# Altium project rpi_pico_2_hat.PrjPcb
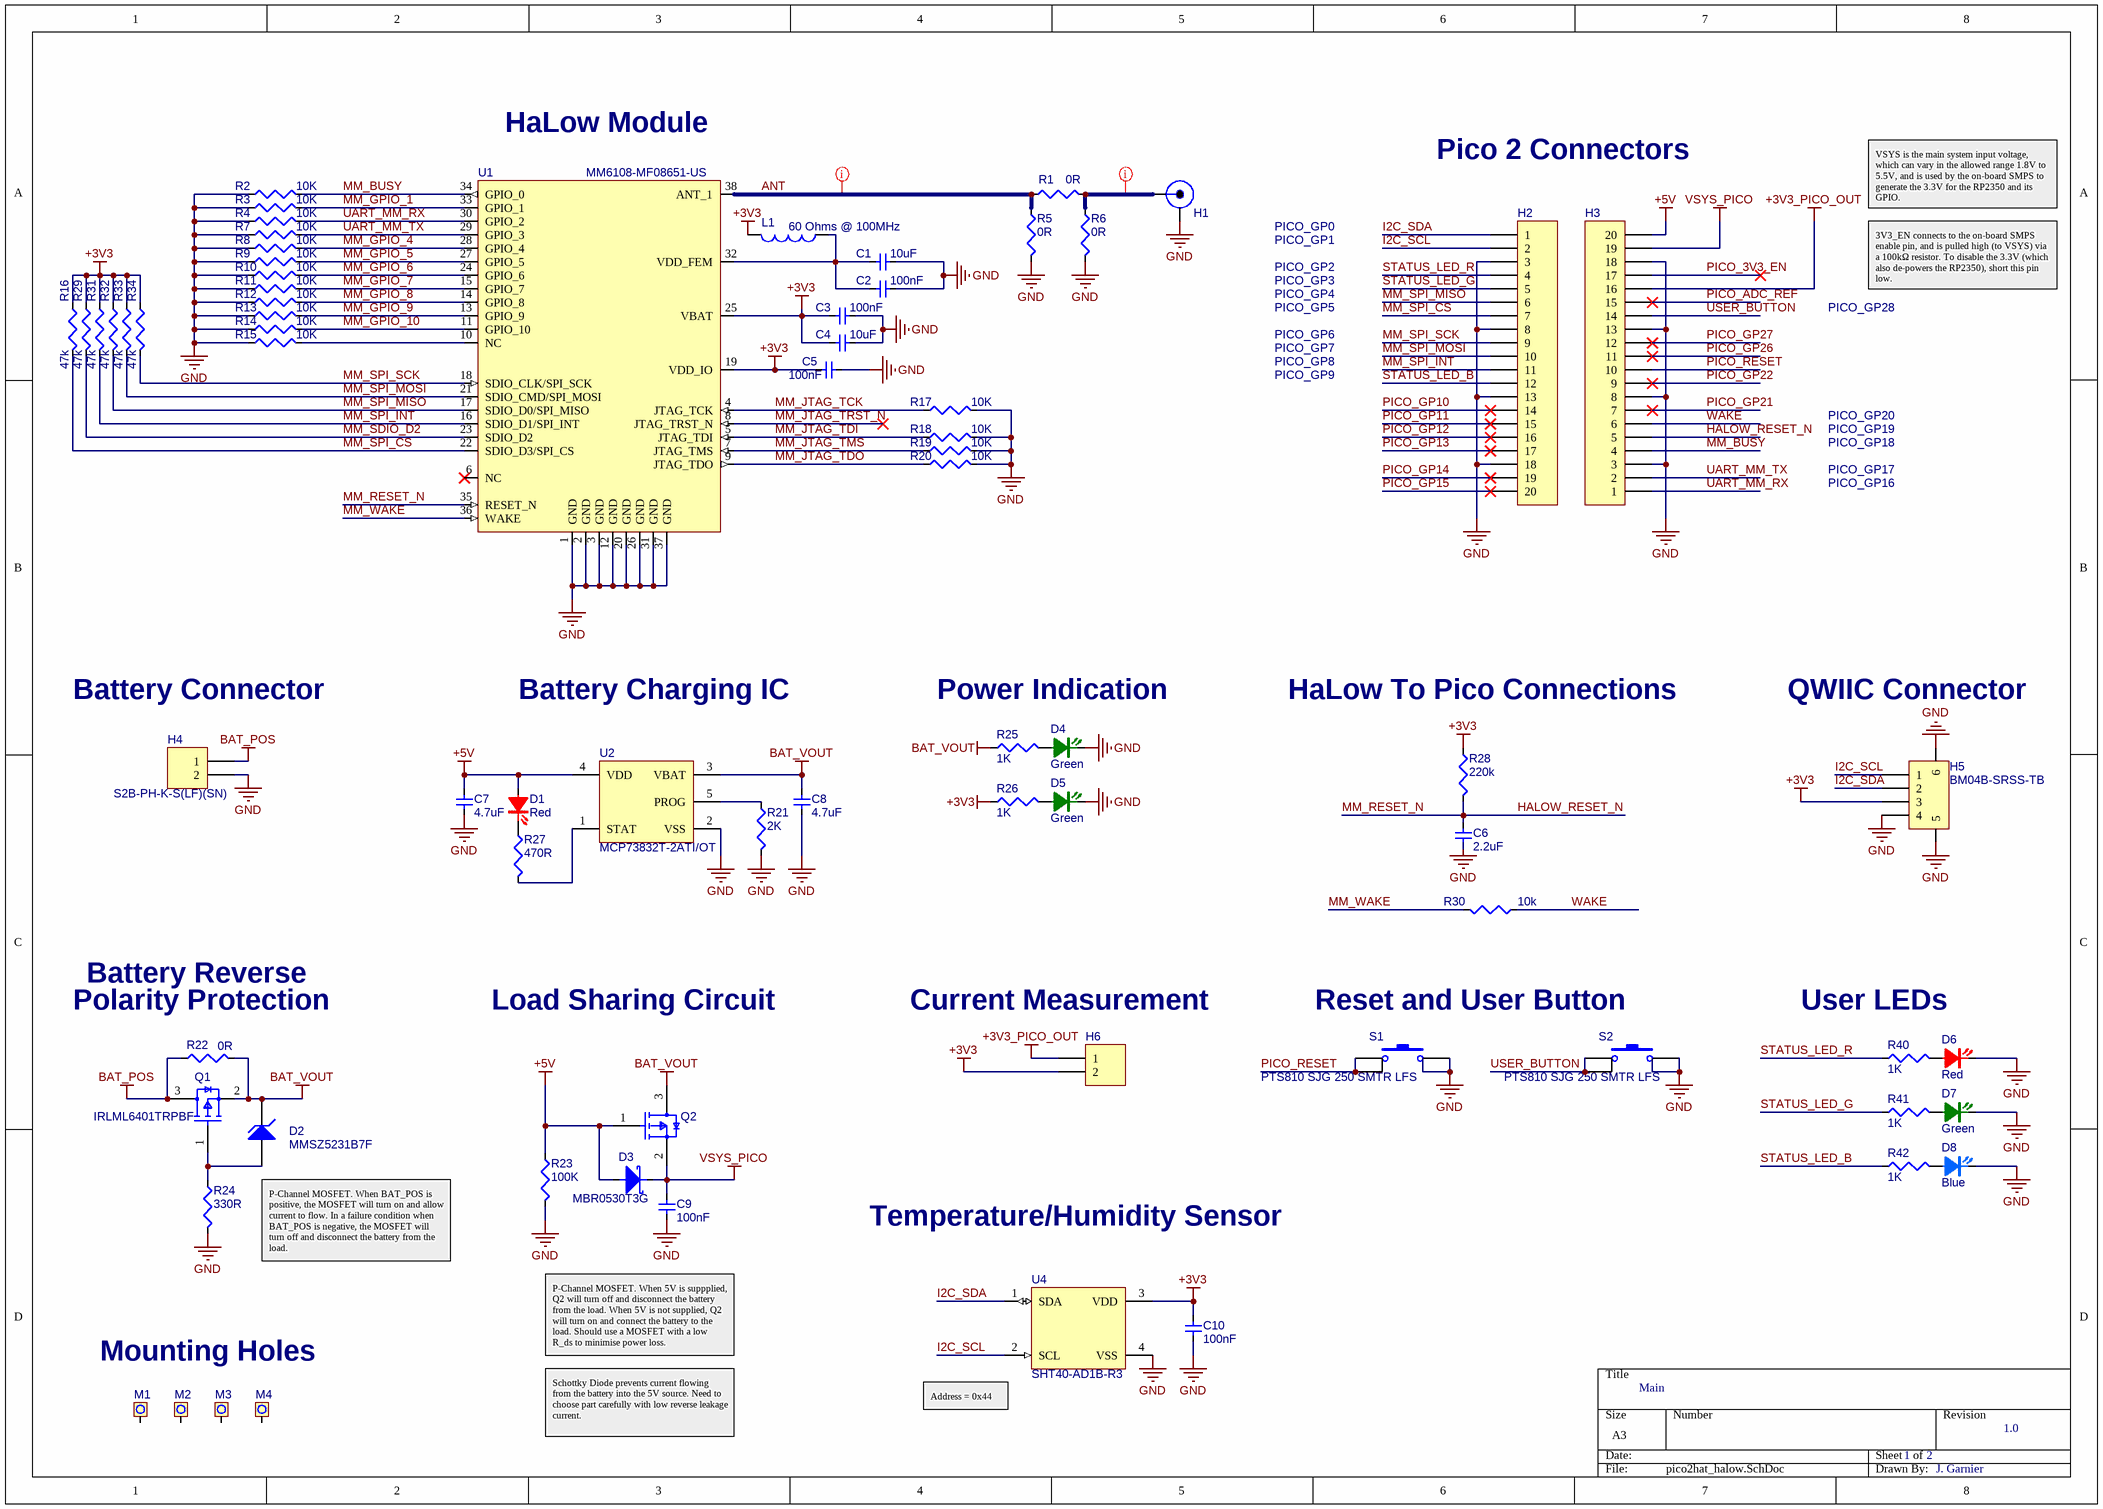
[diagram p0: pico2hat_halow.SchDoc]
Rev: 1.0; DrawnBy: J. Garnier
2 sheets, 73 parts. Net scope: global (net labels, ports and power ports of the same name join across sheets).
Board file: rpi_pico_2_hat.PcbDoc
Sheets:
  pico2hat_halow.SchDoc
  Revision_History.SchDoc

## Sheet pico2hat_halow.SchDoc: Main
size A3; Author: J. Garnier; DrawnBy: J. Garnier; Revision: 1.0; SheetNumber: 1; SheetTotal: 2

### Parts
C1  value 10uF  [0402_cap]  (hidden comment: CL05A106MP8NUB8)
C2  value 100nF  [0402_cap]  (hidden comment: C1005X7R1H104K050BE)
C3  value 100nF  [0402_cap]  (hidden comment: C1005X7R1H104K050BE)
C4  value 10uF  [0402_cap]  (hidden comment: CL05A106MP8NUB8)
C5  value 100nF  [0402_cap]  (hidden comment: C1005X7R1H104K050BE)
C6  value 2.2uF  [CAPC1005X06N]  (hidden comment: CAP)
C7  value 4.7uF  [0402_cap]  (hidden comment: C1005X5R0J475K050BC)
C8  value 4.7uF  [0402_cap]  (hidden comment: C1005X5R0J475K050BC)
C9  value 100nF  [0402_cap]  (hidden comment: C1005X7R1H104K050BE)
C10  value 100nF  [0402_cap]  (hidden comment: C1005X7R1H104K050BE)
D1  value Red  [LED_0805_RED]  (hidden comment: LTST-C170KRKT)
D2  MMSZ5231B7F  [SOD-123FL]
D3  MBR0530T3G  [SOD-123FL]
D4  value Green  [LED_0402_GREEN]  (hidden comment: XZVGR68W-3)
D5  value Green  [LED_0402_GREEN]  (hidden comment: XZVGR68W-3)
D6  value Red  [LED_0805_RED]  (hidden comment: LTST-C170KRKT)
D7  value Green  [LED_0805_GREEN]  (hidden comment: LTST-C170KGKT)
D8  value Blue  [LED_0805_BLUE]  (hidden comment: LTST-C170TBKT)
H1  142-0761-861  [SMA_EMERSON_142_0761_861]  (value not drawn)
H2  1x20 Female Header  [HDR1X20F]  (value not drawn)
H3  1x20 Female Header  [HDR1X20F]  (value not drawn)
H4  S2B-PH-K-S(LF)(SN)  [JST-S2B-PH-K-S_V]
H5  BM04B-SRSS-TB  [FP-BM04B-SRSS-TBT_LF_SN-MFG]
H6  2011-1X02G00SB-1  [HDR1X2]  (value not drawn)
L1  value 60 Ohms @ 100MHz  [0402_ind]  (hidden comment: BLM15PX600SN1D)
M1  PAD0009  [MH_300_275_NPTH]  (value not drawn)
M2  PAD0009  [MH_300_275_NPTH]  (value not drawn)
M3  PAD0009  [MH_300_275_NPTH]  (value not drawn)
M4  PAD0009  [MH_300_275_NPTH]  (value not drawn)
Q1  IRLML6401TRPBF  [FP-SOT23-IPC_A]
Q2  NTS4101PT1G  [FP-419-04-IPC_A]  (value not drawn)
R1  value 0R  [0402_res]  (hidden comment: RC0402JR-070RL)
R2  value 10K  [RESC1005X04N]  (hidden comment: ERJ-2RKF1002X)
R3  value 10K  [RESC1005X04N]  (hidden comment: ERJ-2RKF1002X)
R4  value 10K  [RESC1005X04N]  (hidden comment: ERJ-2RKF1002X)
R5  value 0R  [0402_res]  (hidden comment: RC0402JR-070RL)
R6  value 0R  [0402_res]  (hidden comment: RC0402JR-070RL)
R7  value 10K  [RESC1005X04N]  (hidden comment: ERJ-2RKF1002X)
R8  value 10K  [RESC1005X04N]  (hidden comment: ERJ-2RKF1002X)
R9  value 10K  [RESC1005X04N]  (hidden comment: ERJ-2RKF1002X)
R10  value 10K  [RESC1005X04N]  (hidden comment: ERJ-2RKF1002X)
R11  value 10K  [RESC1005X04N]  (hidden comment: ERJ-2RKF1002X)
R12  value 10K  [RESC1005X04N]  (hidden comment: ERJ-2RKF1002X)
R13  value 10K  [RESC1005X04N]  (hidden comment: ERJ-2RKF1002X)
R14  value 10K  [RESC1005X04N]  (hidden comment: ERJ-2RKF1002X)
R15  value 10K  [RESC1005X04N]  (hidden comment: ERJ-2RKF1002X)
R16  value 47k  [RESC1005X04N]  (hidden comment: MCR01MZPF4702)
R17  value 10K  [RESC1005X04N]  (hidden comment: ERJ-2RKF1002X)
R18  value 10K  [RESC1005X04N]  (hidden comment: ERJ-2RKF1002X)
R19  value 10K  [RESC1005X04N]  (hidden comment: ERJ-2RKF1002X)
R20  value 10K  [RESC1005X04N]  (hidden comment: ERJ-2RKF1002X)
R21  value 2K  [0402_res]  (hidden comment: RC0402FR-072KL)
R22  value 0R  [RESC1608X06N]  (hidden comment: RC0603JR-070RL)
R23  value 100K  [0402_res]  (hidden comment: RC0402FR-07100KL)
R24  value 330R  [RESC1005X04N]  (hidden comment: RC0402FR-07330RL)
R25  value 1K  [RESC1005X04N]  (hidden comment: ERJ-2RKF1001X)
R26  value 1K  [RESC1005X04N]  (hidden comment: ERJ-2RKF1001X)
R27  value 470R  [0402_res]  (hidden comment: RC0402FR-07470RL)
R28  value 220k  [RESC1005X04N]  (hidden comment: RES)
R29  value 47k  [RESC1005X04N]  (hidden comment: MCR01MZPF4702)
R30  value 10k  [RESC1608X06N]  (hidden comment: RES)
R31  value 47k  [RESC1005X04N]  (hidden comment: MCR01MZPF4702)
R32  value 47k  [RESC1005X04N]  (hidden comment: MCR01MZPF4702)
R33  value 47k  [RESC1005X04N]  (hidden comment: MCR01MZPF4702)
R34  value 47k  [RESC1005X04N]  (hidden comment: MCR01MZPF4702)
R40  value 1K  [RESC1005X04N]  (hidden comment: ERJ-2RKF1001X)
R41  value 1K  [RESC1005X04N]  (hidden comment: ERJ-2RKF1001X)
R42  value 1K  [RESC1005X04N]  (hidden comment: ERJ-2RKF1001X)
S1  PTS810 SJG 250 SMTR LFS  [SW_PTS810]
S2  PTS810 SJG 250 SMTR LFS  [SW_PTS810]
U1  MM6108-MF08651-US  [MF04]
U2  MCP73832T-2ATI/OT  [SOT-23-OT5_N]
U4  SHT40-AD1B-R3  [DFN140P150X59-4N]

### Nets
+3V3: C3.1 C4.1 C5.1 C10.2 H5.3 H6.2 L1.2 R16.1 R26.1 R28.1 R29.1 R31.1 R32.1 R33.1 R34.1 U1.19(VDD_IO) U1.25(VBAT) U4.3(VDD)
+3V3_PICO_OUT: H3.16 H6.1
+5V: C7.1 D1.A D3.A H3.20 Q2.1(G) R23.1 U2.4(VDD)
BAT_POS: H4.1 Q1.3(D) R22.1
BAT_VOUT: C8.1 D2.K Q1.2(S) Q2.3(D) R22.2 R25.1 U2.3(VBAT)
GND: C1.2 C2.2 C3.2 C4.2 C5.2 C6.2 C7.2 C8.2 C9.1 C10.1 D4.K D5.K D6.K D7.K D8.K H1.2 H2.3 H2.8 H2.13 H2.18 H3.3 H3.8 H3.13 H3.18 H4.2 H5.4 H5.5 H5.6 R2.1 R3.1 R4.1 R5.2 R6.2 R7.1 R8.1 R9.1 R10.1 R11.1 R12.1 R13.1 R14.1 R15.1 R17.2 R18.2 R19.2 R20.2 R21.2 R23.2 R24.2 S1.3 S1.4 S2.3 S2.4 U1.1(GND) U1.2(GND) U1.3(GND) U1.12(GND) U1.20(GND) U1.26(GND) U1.31(GND) U1.37(GND) U2.2(VSS) U4.4(VSS)
VSYS_PICO: C9.2 D3.K H3.19 Q2.2(S)
ANT: R1.1 R5.1 U1.38(ANT_1)
HALOW_RESET_N: C6.1 H3.5 R28.2 U1.35(RESET_N)  [also labelled MM_RESET_N]
I2C_SCL: H2.2 H5.1 U4.2(SCL)
I2C_SDA: H2.1 H5.2 U4.1(SDA)
MM_BUSY: H3.4 R2.2 U1.34(GPIO_0)
MM_GPIO_1: R3.2 U1.33(GPIO_1)
MM_GPIO_4: R8.2 U1.28(GPIO_4)
MM_GPIO_5: R9.2 U1.27(GPIO_5)
MM_GPIO_6: R10.2 U1.24(GPIO_6)
MM_GPIO_7: R11.2 U1.15(GPIO_7)
MM_GPIO_8: R12.2 U1.14(GPIO_8)
MM_GPIO_9: R13.2 U1.13(GPIO_9)
MM_GPIO_10: R14.2 U1.11(GPIO_10)
MM_JTAG_TCK: R17.1 U1.4(JTAG_TCK)
MM_JTAG_TDI: R18.1 U1.5(JTAG_TDI)
MM_JTAG_TDO: R20.1 U1.9(JTAG_TDO)
MM_JTAG_TMS: R19.1 U1.7(JTAG_TMS)
MM_JTAG_TRST_N: U1.8(JTAG_TRST_N)
MM_SDIO_D2: R29.2 U1.23(SDIO_D2)
MM_SPI_CS: H2.7 R16.2 U1.22(SDIO_D3/SPI_CS)
MM_SPI_INT: H2.11 R31.2 U1.16(SDIO_D1/SPI_INT)
MM_SPI_MISO: H2.6 R32.2 U1.17(SDIO_D0/SPI_MISO)
MM_SPI_MOSI: H2.10 R33.2 U1.21(SDIO_CMD/SPI_MOSI)
MM_SPI_SCK: H2.9 R34.2 U1.18(SDIO_CLK/SPI_SCK)
MM_WAKE: R30.1 U1.36(WAKE)
PICO_3V3_EN: H3.17
PICO_ADC_REF: H3.15
PICO_GP10: H2.14
PICO_GP11: H2.15
PICO_GP12: H2.16
PICO_GP13: H2.17
PICO_GP14: H2.19
PICO_GP15: H2.20
PICO_GP21: H3.7
PICO_GP22: H3.9
PICO_GP26: H3.11
PICO_GP27: H3.12
PICO_RESET: H3.10 S1.1 S1.2
STATUS_LED_B: H2.12 R42.1
STATUS_LED_G: H2.5 R41.1
STATUS_LED_R: H2.4 R40.1
UART_MM_RX: H3.1 R4.2 U1.30(GPIO_2)
UART_MM_TX: H3.2 R7.2 U1.29(GPIO_3)
USER_BUTTON: H3.14 S2.1 S2.2
WAKE: H3.6 R30.2
NetC1_1: C1.1 C2.1 L1.1 U1.32(VDD_FEM)
NetD1_K: D1.K R27.1
NetD2_A: D2.A Q1.1(G) R24.1
NetD4_A: D4.A R25.2
NetD5_A: D5.A R26.2
NetD6_A: D6.A R40.2
NetD7_A: D7.A R41.2
NetD8_A: D8.A R42.2
NetH1_1: H1.1 R1.2 R6.1
NetR15_2: R15.2 U1.10(NC)
NetR21_1: R21.1 U2.5(PROG)
NetR27_2: R27.2 U2.1(STAT)

Not connected (* = marked no-connect by the designer): M1 1; M2 1; M3 1; M4 1; U1 6(NC)*

### Layout directives
net class 50 OHMs: ANT, NetH1_1

### Notes on the sheet
- HaLow Module
- Pico 2 Connectors
- PICO_GP0
- PICO_GP1
- VSYS is the main system input voltage, which can vary in the allowed range 1.8V to 5.5V, and is used by the on-board SMPS to generate the 3.3V for the RP2350 and its GPIO.
- PICO_GP5
- PICO_GP2
- PICO_GP3
- PICO_GP4
- PICO_GP28
- 3V3_EN connects to the on-board SMPS enable pin, and is pulled high (to VSYS) via a 100kΩ resistor. To disable the 3.3V (which also de-powers the RP2350), short this pin low.
- PICO_GP6
- PICO_GP8
- PICO_GP7
- PICO_GP9
- PICO_GP19
- PICO_GP18
- PICO_GP20
- PICO_GP16
- PICO_GP17
- Battery Connector
- Battery Charging IC
- Power Indication
- (near R28) HaLow To Pico Connections
- QWIIC Connector
- Battery Reverse
- (near R22) Polarity Protection
- Load Sharing Circuit
- (near H6) Current Measurement
- Reset and User Button
- User LEDs
- P-Channel MOSFET. When BAT_POS is positive, the MOSFET will turn on and allow current to flow. In a failure condition when BAT_POS is negative, the MOSFET will turn off and disconnect the battery from the load.
- Temperature/Humidity Sensor
- Mounting Holes
- P-Channel MOSFET. When 5V is suppplied, Q2 will turn off and disconnect the battery from the load. When 5V is not supplied, Q2 will turn on and connect the battery to the load. Should use a MOSFET with a low R_ds to minimise power loss.
- Schottky Diode prevents current flowing from the battery into the 5V source. Need to choose part carefully with low reverse leakage current.
- (near U4) Address = 0x44
- Level 8, 10-14 Waterloo Street
- Surry Hills, NSW 2010
- Drawn:
- Checked:
- Morse Micro
- Title
- AUSTRALIA
- (c) Copyright 2024
- Approved:
- Date Released:
- Drawing No:
- PCBA No:
- Drawing
- Revision:
- Size:
- A3
- File:
- Sheet
- of

### Library data of the parts
C1 C4 = CAP0046-13: CAP CER 10UF 10V 20% X5R 0402; Generic Allowed: Yes; Subtype: Ceramic; Package: 0402; Tolerance: 20%; ClassName: CHIP_MICRO; Voltage: 10V
C2 C3 C5 C9 C10 = CAP0068-11: CAP CER 100NF 50V ±10% X7R 0402; Subtype: Ceramic; Generic Allowed: Yes; Voltage: 50V; ClassName: CHIP_MICRO; Package: 0402; Tolerance: 10%; Component Rating: X7R
C6 = CAP0086: CAP CER 2.2UF 6.3V 20% X5R 0402; Manufacturer 1: Taiyo Yuden; Manufacturer Part Number 1: JMK105BJ225MV-F; Generic Allowed: Yes; Subtype: Ceramic; Item_Number: CAP0086; Supplier 1: Digi-Key; Supplier Part Number 1: 587-1453-2-ND; ClassName: CHIP_MICRO; Component Rating: X5R; Package: 0402; Tolerance: 20%; Voltage: 6.3V
C7 C8 = CAP0075-12: CAP CER 4.7UF 6.3V ±10% X5R 0402; Generic Allowed: Yes; Subtype: Ceramic; Voltage: 6.3V; ClassName: CHIP_MICRO; Package: 0402; Component Rating: X5R; Tolerance: 10%
D1 D6 = DIO0016-2: LED, Red Clear,2.0V, SMD, 0805, RoHS; Generic Allowed: Yes; Component Rating: Clear, 2.0V; Package: SMD-0805; ClassName: CHIP_OTHER
D2 = DIO0072-1: DIODE ZENER 5.1V 500MW SOD-123
D3 = DIO0044-2: DIODE SCHOTTKY 30V 500MA SOD123; Generic Allowed: Yes; ClassName: COMP_OTHER; Voltage: 30V; Package: SOD-123; Current: 500mA; Value: MBR0530T3G
D4 D5 = DIO0053-3: LED GREEN 0402 SMD; Voltage: 2.0V; Generic Allowed: Yes; Package: 0402; ClassName: CHIP_OTHER
D7 = DIO0015-2: LED, Green Clear,2.0V, SMD, 0805, RoHS; Generic Allowed: Yes; Component Rating: Clear, 2.0V; Package: SMD-0805; ClassName: CHIP_OTHER
D8 = DIO0018-2: LED, Blue Clear,3.3V, SMD, 0805, RoHS; Generic Allowed: Yes; ClassName: CHIP_OTHER; Component Rating: Clear, 3.3V; Package: SMD-0805
H1 = JCK0001-2: Conn, SMA Jack 50 Ohm PCB Edge Mount Gold, RoHS; Generic Allowed: No; ClassName: COMP_OTHER; Package: Edge Mnt
H2 H3 = HDR0128-1
H4 = HDR0129-2: Header for PCB; pitch 2.00mm; 2-contacts; THT; male; side entry; 100V/2A
H5 = HDR0131-2: Board Connector, 4 Contact(s), 1 Row(s), Male, Straight, Surface Mount Terminal
H6 = HDR0006-2: Conn Straight Header 2x1 0.100" 2 POS; Generic Allowed: Yes; Package: THRU-Hole; ClassName: COMP_OTHER; Pins: 2
L1 = IND0062-6: BEAD 60OHMS 2500MA 32 MOHM; DC Resistance: 32mOhm; Generic Allowed: Yes; Current: 2.5A; Resistance: 32mOhm; Package: 0402; ClassName: CHIP_MICRO
M1-M4 = PAD0009-2: MH NPTH 3.00mm DIA 2.75mm HOLE; Shape: Round; ClassName: PCB_PATTERN
Q1 = TSR0020-1: Small Signal Field-Effect Transistor; Transistor Element Material: SILICON; Drain-source On Resistance-Max: 50mR; Power Dissipation-Max (Abs): 1.3W; Drain Current-Max (Abs) (ID): 4.3A; Polarity/Channel Type: P-CHANNEL; Number of Elements: 1; DS Breakdown Voltage-Min: 12V; Transistor Application: SWITCHING; FET Technology: METAL-OXIDE SEMICONDUCTOR; Qualification Status: Not Qualified; Additional Feature: HIGH RELIABILITY; Operating Mode: ENHANCEMENT MODE; Avalanche Energy Rating (Eas): 33mJ; Pulsed Drain Current-Max (IDM): 34A; Package Body Material: Plastic; Time @ Peak Reflow Temperature-Max (s): 30s; Package Shape: Rectangular; RoHS Compliant: Yes; Max Operating Temperature: 150°C; Terminal Finish: Tin; JESD-30 Code: R-PDSO-G3; Reach SVHC Compliant: Yes; Terminal Form: Gull Wing; Moisture Sensitivity Level: 1; Terminal Position: DUAL; Package Style: SMALL OUTLINEMeter; JESD-609 Code: e3; Peak Reflow Temperature (Cel): 260°C; Surface Mount: Yes; Drain Current-Max (ID): 4.3A; Pins: 3
Q2 = TSR0021-1: Small Signal Field-Effect Transistor, 1.37A I(D), 20V, 1-Element, P-Channel, Silicon, Metal-oxide Semiconductor FET; Qualification Status: Not Qualified; Power Dissipation-Max (Abs): 329mW; Feedback Cap-Max (Crss): 85pF; Operating Mode: ENHANCEMENT MODE; Transistor Application: SWITCHING; Time @ Peak Reflow Temperature-Max (s): 40s; Drain-source On Resistance-Max: 120mR; Number of Elements: 1; Package Body Material: Plastic; Terminal Position: DUAL; FET Technology: METAL-OXIDE SEMICONDUCTOR; Terminal Form: Gull Wing; Pins: 3; Reach SVHC Compliant: Yes; DS Breakdown Voltage-Min: 20V; JESD-609 Code: e3; Surface Mount: Yes; Peak Reflow Temperature (Cel): 260°C; Drain Current-Max (Abs) (ID): 1.37A; JESD-30 Code: R-PDSO-G3; Package Style: SMALL OUTLINEMeter; Max Operating Temperature: 150°C; Moisture Sensitivity Level: 1; Drain Current-Max (ID): 1.37A; Terminal Finish: Tin; Transistor Element Material: SILICON; RoHS Compliant: Yes; Package Shape: Rectangular; Polarity/Channel Type: P-CHANNEL
R1 R5 R6 = RES0039-10: RES SMD 0R OHM ±1% 1/16W 0402; Generic Allowed: Yes; Subtype: Thin Film; Power: 1/16W; Tolerance: 1%; Package: 0402; ClassName: CHIP_MICRO
R2-R4 R7-R15 R17-R20 = RES0002-8: RES SMD 10K OHM ±1% 1/10W 0402; Generic Allowed: Yes; Tolerance: 1%; ClassName: CHIP_MICRO; Package: 0402; Power: 1/10W
R16 R29 R31-R34 = RES0086-8: RES SMD 47K OHM ±1% 1/16W 0402; Generic Allowed: Yes; ClassName: CHIP_MICRO; Power: 1/16W; Package: 0402; Tolerance: 1%
R21 = RES0030-9: RES SMD 2K OHM ±1% 1/16W 0402; Generic Allowed: Yes; Package: 0402; ClassName: CHIP_MICRO; Power: 1/16W; Tolerance: 1%
R22 = RES0119-6: RES SMD 0R OHM ±5% 1/10W 0603; Generic Allowed: Yes; Power: 1/10W; Tolerance: 5%; Package: 0603; ClassName: CHIP_OTHER
R23 = RES0023-9: RES SMD 100K OHM ±1% 1/16W 0402; Generic Allowed: Yes; Tolerance: 1%; Package: 0402; ClassName: CHIP_MICRO; Power: 1/16W
R24 = RES0025-8: RES SMD 330R OHM ±1% 1/16W 0402; Generic Allowed: Yes; Tolerance: 1%; Power: 1/16W; Package: 0402; ClassName: CHIP_MICRO
R25 R26 R40-R42 = RES0004-8: RES SMD 1K OHM ±1% 1/10W 0402; Generic Allowed: Yes; Power: 1/10W; Tolerance: 1%; Package: 0402; ClassName: CHIP_MICRO
R27 = RES0084-9: RES SMD 470R OHM ±1% 1/16W 0402; Generic Allowed: Yes; ClassName: CHIP_MICRO; Tolerance: 1%; Package: 0402; Power: 1/16W
R28 = RES0064: Res, 220k Ohms, 1/16W, 1%, 0402,SMD; Manufacturer 1: Rohm; Manufacturer Part Number 1: MCR01MZPF2203; Generic Allowed: Yes; Item_Number: RES0064; Supplier 1: Digi-Key; Supplier Part Number 1: 311-220KLRCT-ND; ClassName: CHIP_MICRO; Package: 0402; Power: 1/16W; Tolerance: 1%; Manufacturer 2: Yageo; Manufacturer Part Number 2: RC0402FR-07220KL; Supplier 2: Digi-Key; Supplier Part Number 2: 311-220KLRTR-ND
R30 = RES0124: Res, 10K Ohm, 1/10W,+/-1%,0603 RoHS; Manufacturer 1: Rohm; Manufacturer Part Number 1: MCR03EZPFX1002; Generic Allowed: Yes; Tolerance: 1%; Item_Number: RES0124; Supplier 1: Digi-Key; Supplier Part Number 1: 311-10.0KHRCT-ND; Package: 0603; Power: 1/10W; Manufacturer 2: Yageo; Manufacturer Part Number 2: RC0603FR-0710KL; Supplier 2: Digi-Key; Supplier Part Number 2: 311-10.0KHRTR-ND; ClassName: CHIP_OTHER
S1 S2 = SWH0026-1: SWITCH TACTILE SPST-NO 0.05A 16V; Generic Allowed: No; Value: PTS810 SJG 250 SMTR LFS; ClassName: COMP_OTHER; Pins: 4; Package: SMD
U1 = MOD0010-3: MM61xx-MF08; Item_Number: MOD0061; Value: MM61xx-MF08251; ClassName: COM_OTHER
U2 = ICT0232-1: Power Supply Support Circuit, Adjustable, 1 Channel, PDSO5; Time @ Peak Reflow Temperature-Max (s): 40s; Adjustable Threshold: Yes; Package Body Material: Plastic; Supply Current-Max (Isup): 1.5mA; Qualification Status: Not Qualified; Power Supplies: 3.3/5V; Channels: 1; Max Supply Voltage: 6V; Package Equivalence Code: TSOP5/6,.11,37; Min Supply Voltage: 3.75V; Terminal Pitch: 0.95mm; RoHS Compliant: Yes; Peak Reflow Temperature (Cel): 260°C; JESD-30 Code: R-PDSO-G5; Case/Package: LSSOP; Reach SVHC Compliant: Yes; Package Shape: Rectangular; Min Operating Temperature: -40°C; JESD-609 Code: e3; Surface Mount: Yes; Terminal Position: DUAL; Moisture Sensitivity Level: 1; Temperature Grade: INDUSTRIAL; Height - Seated (Max): 1.45mm; Max Operating Temperature: 85°C; Terminal Form: Gull Wing; Package Style: SMALL OUTLINE, LOW PROFILE, SHRINK PITCHMeter; Pins: 5; Terminal Finish: Tin; Width: 1.65mm; Throw Configuration: POWER SUPPLY SUPPORT CIRCUIT; Number of Channels: 1; Length: 2.95mm
U4 = ICT0108-3: IC, Humidity Temperature Sensor 0 ~ 100% RH I²C ±1.8% RH 6 s Surface Mount; Generic Allowed: No; ClassName: CHIP_OTHER; Value: SHT40-AD1B-R3; Package: DFN-4

## Sheet Revision_History.SchDoc: Revision History
size A4; Author: J. Garnier; DrawnBy: J. Garnier; Revision: 1.0; SheetNumber: 2; SheetTotal: 2
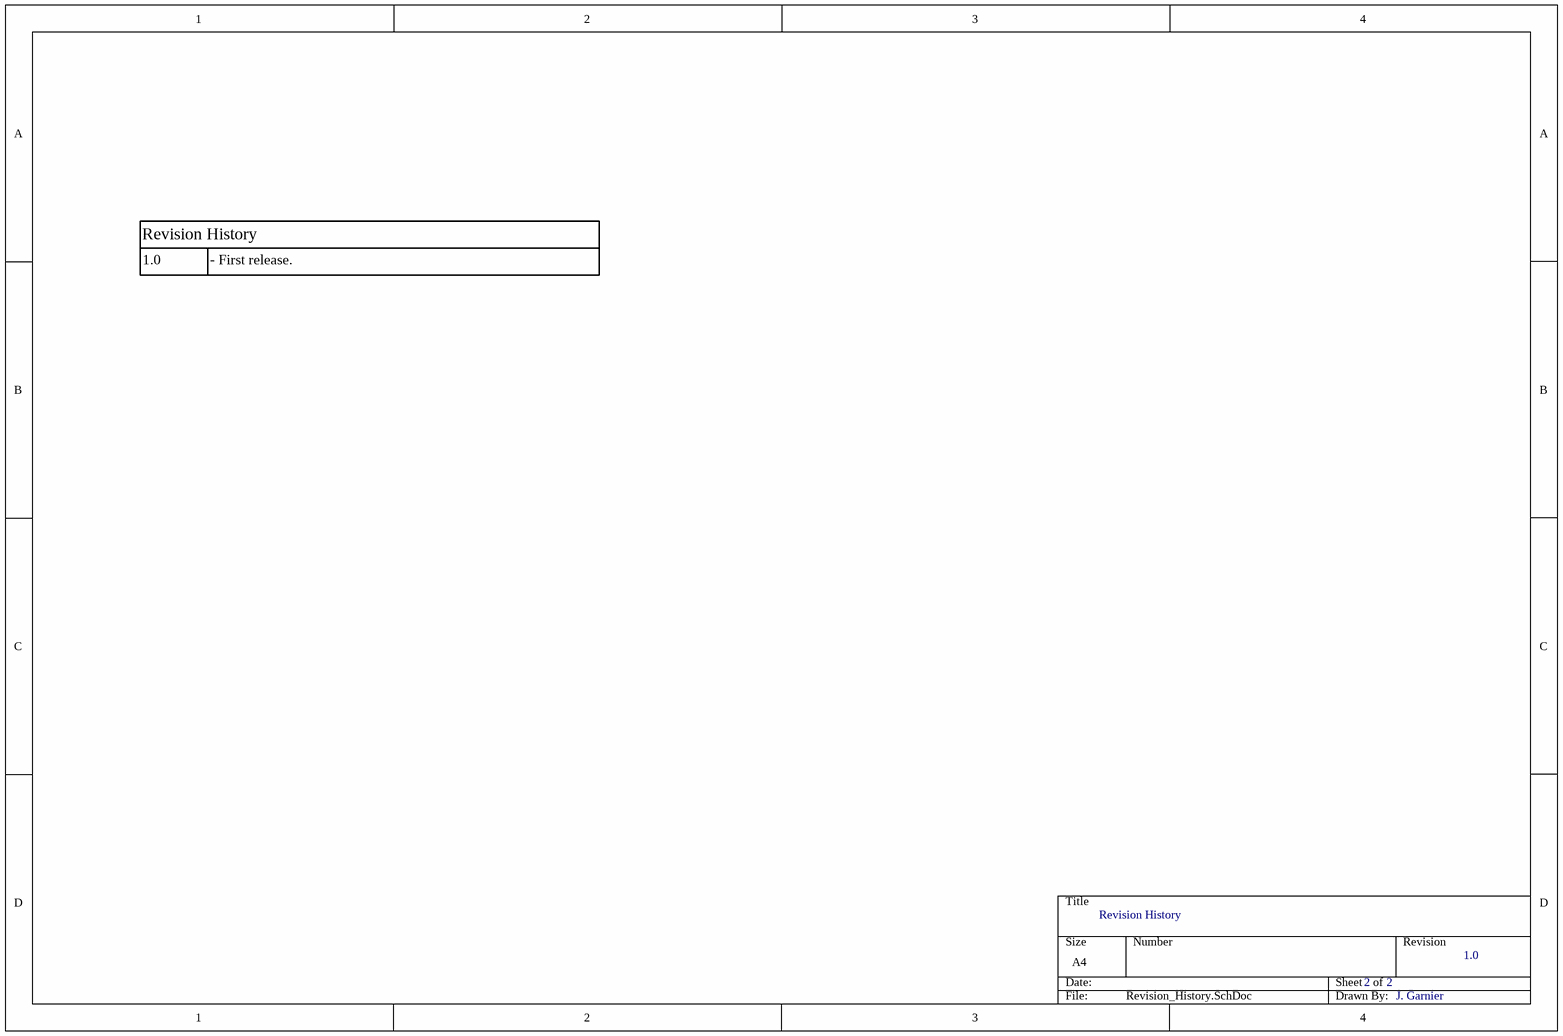
[diagram p1: Revision_History.SchDoc]

### Notes on the sheet
- Revision History
- 1.0
- - First release.
- Drawn:
- Morse Micro
- Title
- Level 8, 10-14 Waterloo Street
- Surry Hills, NSW 2010
- AUSTRALIA
- (c) Copyright 2024
- Checked:
- Approved:
- Date Released:
- Drawing No:
- PCBA No:
- Drawing
- Revision:
- Size:
- A4
- File:
- Sheet
- of

## Assembly variants
Default Variant of rpi_pico_2_hat: not fitted D4 D5 R22 R25 R26 R28 R34